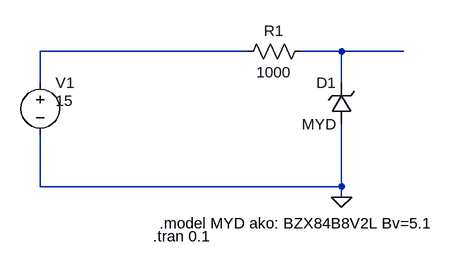
[diagram p0: schematic ShifterSpice.asc]
ShifterSpice.asc, the LTspice schematic file:
Version 4
SHEET 1 880 680
WIRE 112 64 -208 64
WIRE 256 64 192 64
WIRE 352 64 256 64
WIRE -208 112 -208 64
WIRE 256 112 256 64
WIRE -208 272 -208 192
WIRE 256 272 256 176
WIRE 256 272 -208 272
WIRE 256 288 256 272
FLAG 256 288 0
SYMBOL res 208 48 R90
WINDOW 0 0 56 VBottom 2
WINDOW 3 32 56 VTop 2
SYMATTR InstName R1
SYMATTR Value 1000
SYMBOL zener 272 176 R180
WINDOW 0 24 64 Left 2
WINDOW 3 24 0 Left 2
SYMATTR InstName D1
SYMATTR Value MYD
SYMBOL voltage -208 96 R0
WINDOW 3 24 44 Left 2
WINDOW 123 0 0 Left 0
WINDOW 39 0 0 Left 0
SYMATTR InstName V1
SYMATTR Value 15
TEXT -24 328 Left 2 !.model MYD ako: BZX84B8V2L Bv=5.1
TEXT -34 348 Left 2 !.tran 0.1

The netlist it stands for:
* ShifterSpice.asc
R1 N002 N001 1000
D1 0 N002 MYD
V1 N001 0 15
.model D D
.lib standard.dio
.model MYD ako: BZX84B8V2L Bv=5.1
.tran 0.1
.backanno
.end